# EAGLE design controller_rev4 (EAGLE 9.3.0)

## Sheet 1 of 3: Controller
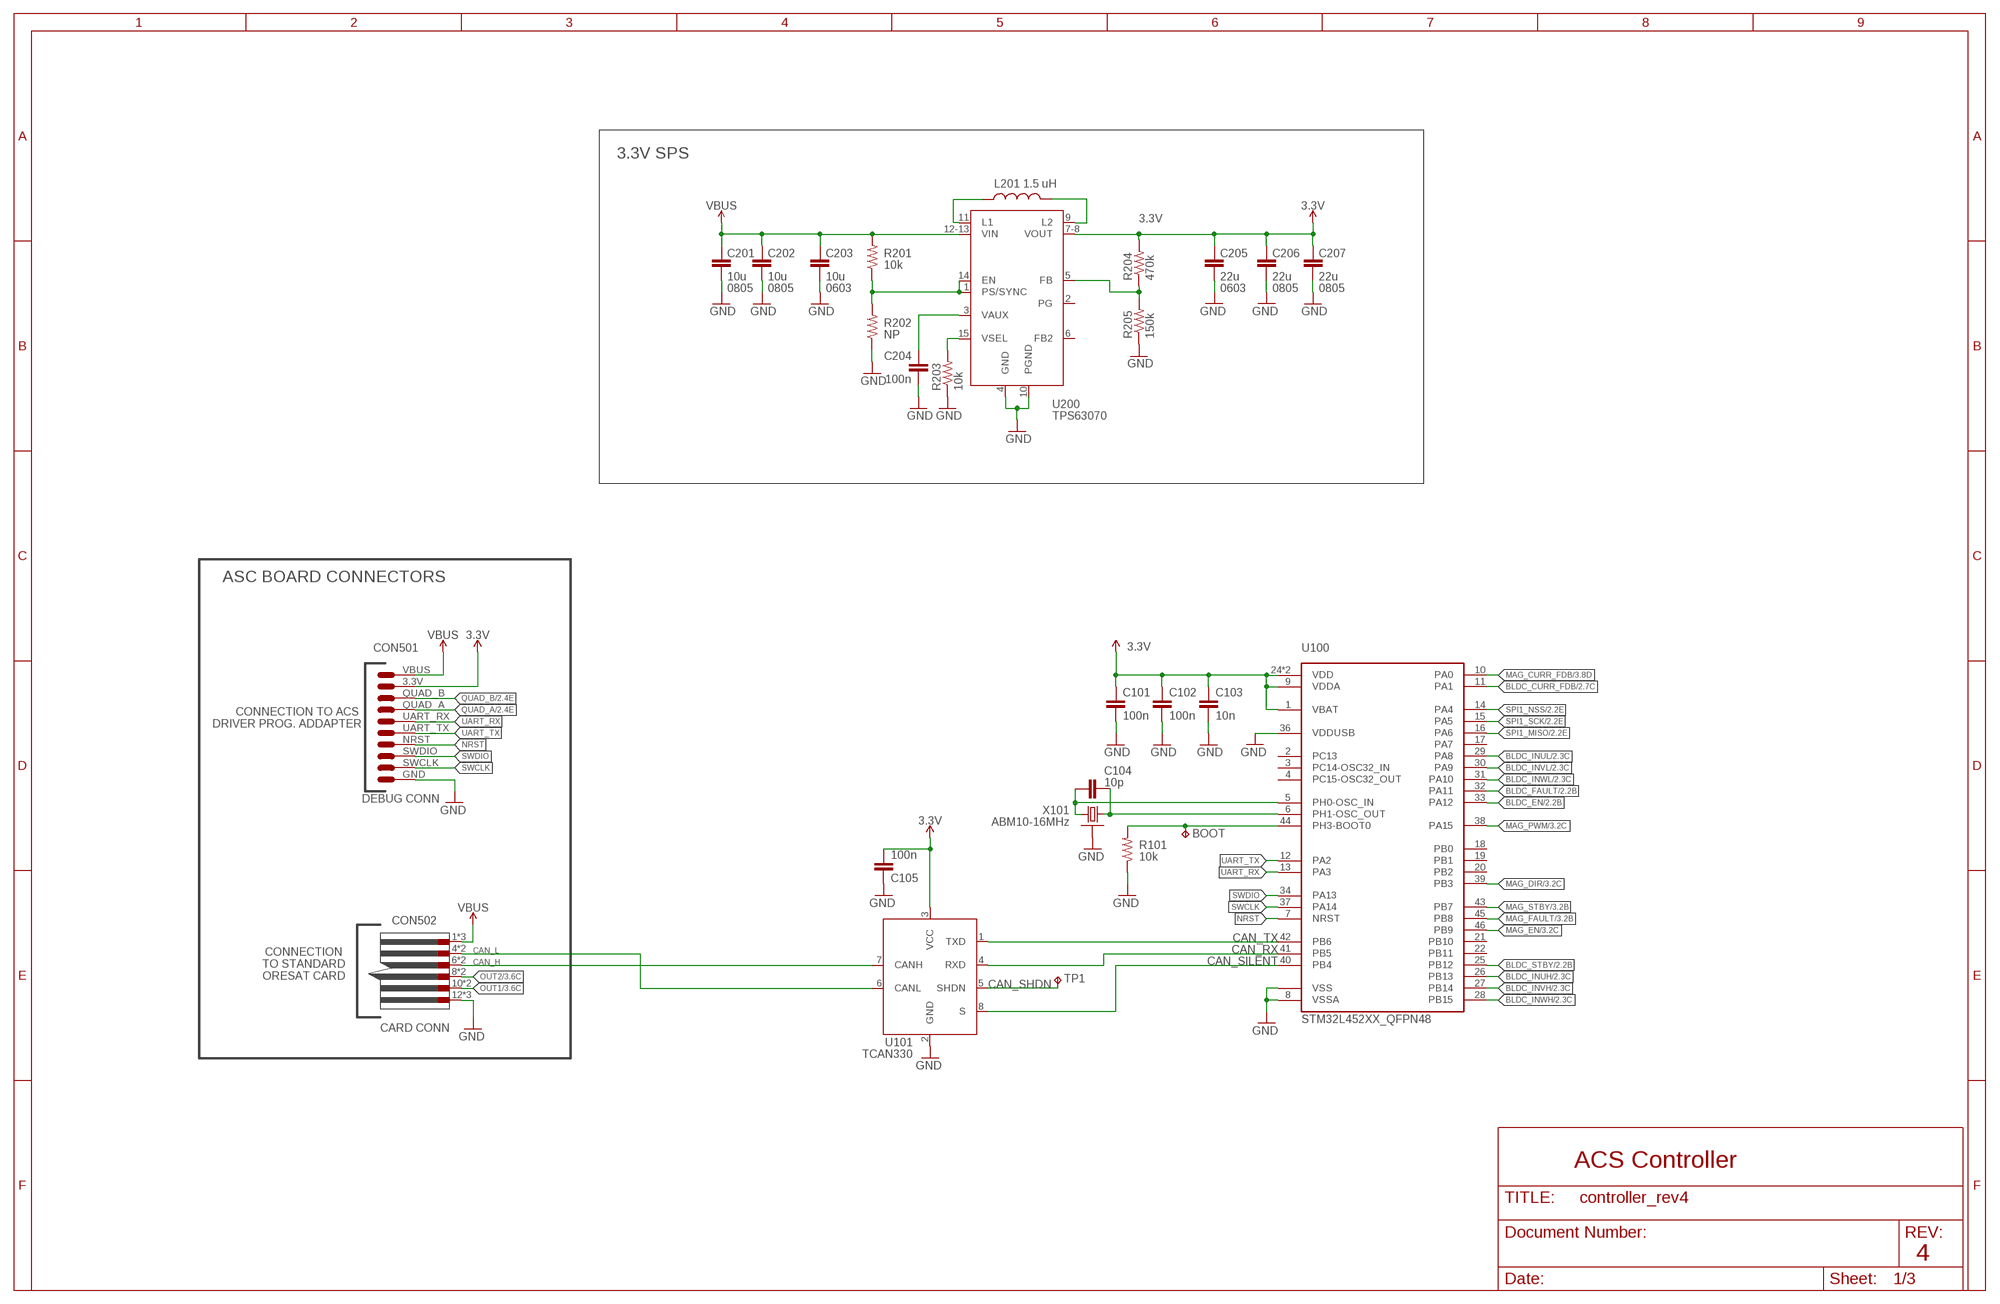
[diagram p0: schematic, sheet 1]

### Parts
BOOT  TPTP15SQ  [TP15SQ]
C101  100n  C-EU0402-B-NOSILK  [.0402-B-NOSILK]
C102  100n  C-EU0402-B-NOSILK  [.0402-B-NOSILK]
C103  10n  C-EU0402-B-NOSILK  [.0402-B-NOSILK]
C104  10p  C-EU0402-B-NOSILK  [.0402-B-NOSILK]
C105  100n  C-EU0402-B-NOSILK  [.0402-B-NOSILK]
C201  10u  C-EU0805-B-NOSILK  [.0805-B-NOSILK]
C202  10u  C-EU0805-B-NOSILK  [.0805-B-NOSILK]
C203  10u  C-EU0603-B-NOSILK  [.0603-B-NOSILK]
C204  100n  C-EU0402-B-NOSILK  [.0402-B-NOSILK]
C205  22u  C-EU0603-B-NOSILK  [.0603-B-NOSILK]
C206  22u  C-EU0805-B-NOSILK  [.0805-B-NOSILK]
C207  22u  C-EU0805-B-NOSILK  [.0805-B-NOSILK]
C501  DEBUG_CON  [DEBUG_CON]
CON502  CARD CONN  LOW-PROFILE_CONNECTOR(TAB)  [LOW-PROFILE_CONNECTOR(TAB)]
L201  1.5 uH  L-COILCRAFT-XFL4020  [L-COILCRAFT-XFL4020]
R101  10k  R-US_0402-B-NOSILK  [.0402-B-NOSILK]
R201  10k  R-US_0402-B-NOSILK  [.0402-B-NOSILK]
R202  NP  R-US_0402-B-NOSILK  [.0402-B-NOSILK]
R203  10k  R-US_0402-B-NOSILK  [.0402-B-NOSILK]
R204  470k  R-US_0402-B-NOSILK  [.0402-B-NOSILK]
R205  150k  R-US_0402-B-NOSILK  [.0402-B-NOSILK]
TP1  TPTP06R  [TP06R]
U100  STM32L452XX_QFPN48  [QFPN-48]
U101  TCAN330  [SOT23-8_TI-DCN]
U200  TPS63070  TPS63070X  [TPS63070X]
X101  ABM10-16MHz  CRYSTAL-WITH-GND  [CRYSTAL_2.5X2]

### Nets
3.3V: C101.1 C102.1 C103.1 C105.2 C205.1 C206.1 C207.1 C501.3.3V R204.2 U100.1(VBAT) U100.9(VDDA) U100.24(VDD) U100.48(VDD) U101.3(VCC) U200.7-8(VOUT) ; also sheet 2,3
BLDC_CURR_FDB: U100.11(PA1) ; also sheet 2
BLDC_EN: U100.33(PA12) ; also sheet 2
BLDC_FAULT: U100.32(PA11) ; also sheet 2
BLDC_INUH: U100.26(PB13) ; also sheet 2
BLDC_INUL: U100.29(PA8) ; also sheet 2
BLDC_INVH: U100.27(PB14) ; also sheet 2
BLDC_INVL: U100.30(PA9) ; also sheet 2
BLDC_INWH: U100.28(PB15) ; also sheet 2
BLDC_INWL: U100.31(PA10) ; also sheet 2
BLDC_STBY: U100.25(PB12) ; also sheet 2
BOOT: BOOT.TP R101.2 U100.44(PH3-BOOT0)
CAN_H: CON502.6 CON502.7 U101.7(CANH)
CAN_L: CON502.4 CON502.5 U101.6(CANL)
CAN_RX: U100.41(PB5) U101.4(RXD)
CAN_SHDN: TP1.TP U101.5(SHDN)
CAN_SILENT: U100.40(PB4) U101.8(S)
CAN_TX: U100.42(PB6) U101.1(TXD)
CLK1: C104.1 U100.5(PH0-OSC_IN) X101.3
CLK2: C104.2 U100.6(PH1-OSC_OUT) X101.1
GND: C101.2 C102.2 C103.2 C105.1 C201.2 C202.2 C203.2 C204.2 C205.2 C206.2 C207.2 C501.GND CON502.12 CON502.13 CON502.14 R101.1 R202.1 R203.1 R205.1 U100.8(VSSA) U100.23(VSS) U100.35(VSS) U100.36(VDDUSB) U100.47(VSS) U100.EPAD(VSS) U101.2(GND) U200.4(GND) U200.10(PGND) X101.2(SHIELD) X101.4(SHIELD) ; also sheet 2,3
MAG_CURR_FDB: U100.10(PA0) ; also sheet 3
MAG_DIR: U100.39(PB3) ; also sheet 3
MAG_EN: U100.46(PB9) ; also sheet 3
MAG_FAULT: U100.45(PB8) ; also sheet 3
MAG_PWM: U100.38(PA15) ; also sheet 3
MAG_STBY: U100.43(PB7) ; also sheet 3
NRST: C501.NRST U100.7(NRST)
OUT1: CON502.10 CON502.11 ; also sheet 3
OUT2: CON502.8 CON502.9 ; also sheet 3
QUAD_A: C501.QUAD_A ; also sheet 2
QUAD_B: C501.QUAD_B ; also sheet 2
SPI1_MISO: U100.16(PA6) ; also sheet 2
SPI1_NSS: U100.14(PA4) ; also sheet 2
SPI1_SCK: U100.15(PA5) ; also sheet 2
SWCLK: C501.SWCLK U100.37(PA14)
SWDIO: C501.SWDIO U100.34(PA13)
TPS-EN2: R201.1 R202.2 U200.1(PS/SYNC) U200.14(EN)
TPS-FB2: R204.1 R205.2 U200.5(FB)
TPS-L5: L201.1 U200.11(L1)
TPS-L6: L201.2 U200.9(L2)
TPS-VAUX2: C204.1 U200.3(VAUX)
TPS-VSEL2: R203.2 U200.15(VSEL)
UART_RX: C501.UART_RX U100.13(PA3)
UART_TX: C501.UART_TX U100.12(PA2)
V_BATT: C501.VBUS ; supply symbol labelled VBUS
VBUS: C201.1 C202.1 C203.1 CON502.1 CON502.2 CON502.3 R201.2 U200.12-13(VIN) ; also sheet 2,3
Unconnected: U100.2(PC13) U100.3(PC14-OSC32_IN) U100.4(PC15-OSC32_OUT) U100.17(PA7) U100.18(PB0) U100.19(PB1) U100.20(PB2) U100.21(PB10) U100.22(PB11) U200.2(PG) U200.6(FB2)

### Notes on the sheet
- 3.3V SPS
- 0805 | 0805 | 0603 | 0603 | 0805 | 0805
- ASC BOARD CONNECTORS
- CON501
- CONNECTION TO ACS 
  DRIVER PROG. ADDAPTER
- DEBUG CONN
- CONNECTION 
  TO STANDARD
  ORESAT CARD
- ACS Controller
- 4

## Sheet 2 of 3: Reaction Wheel
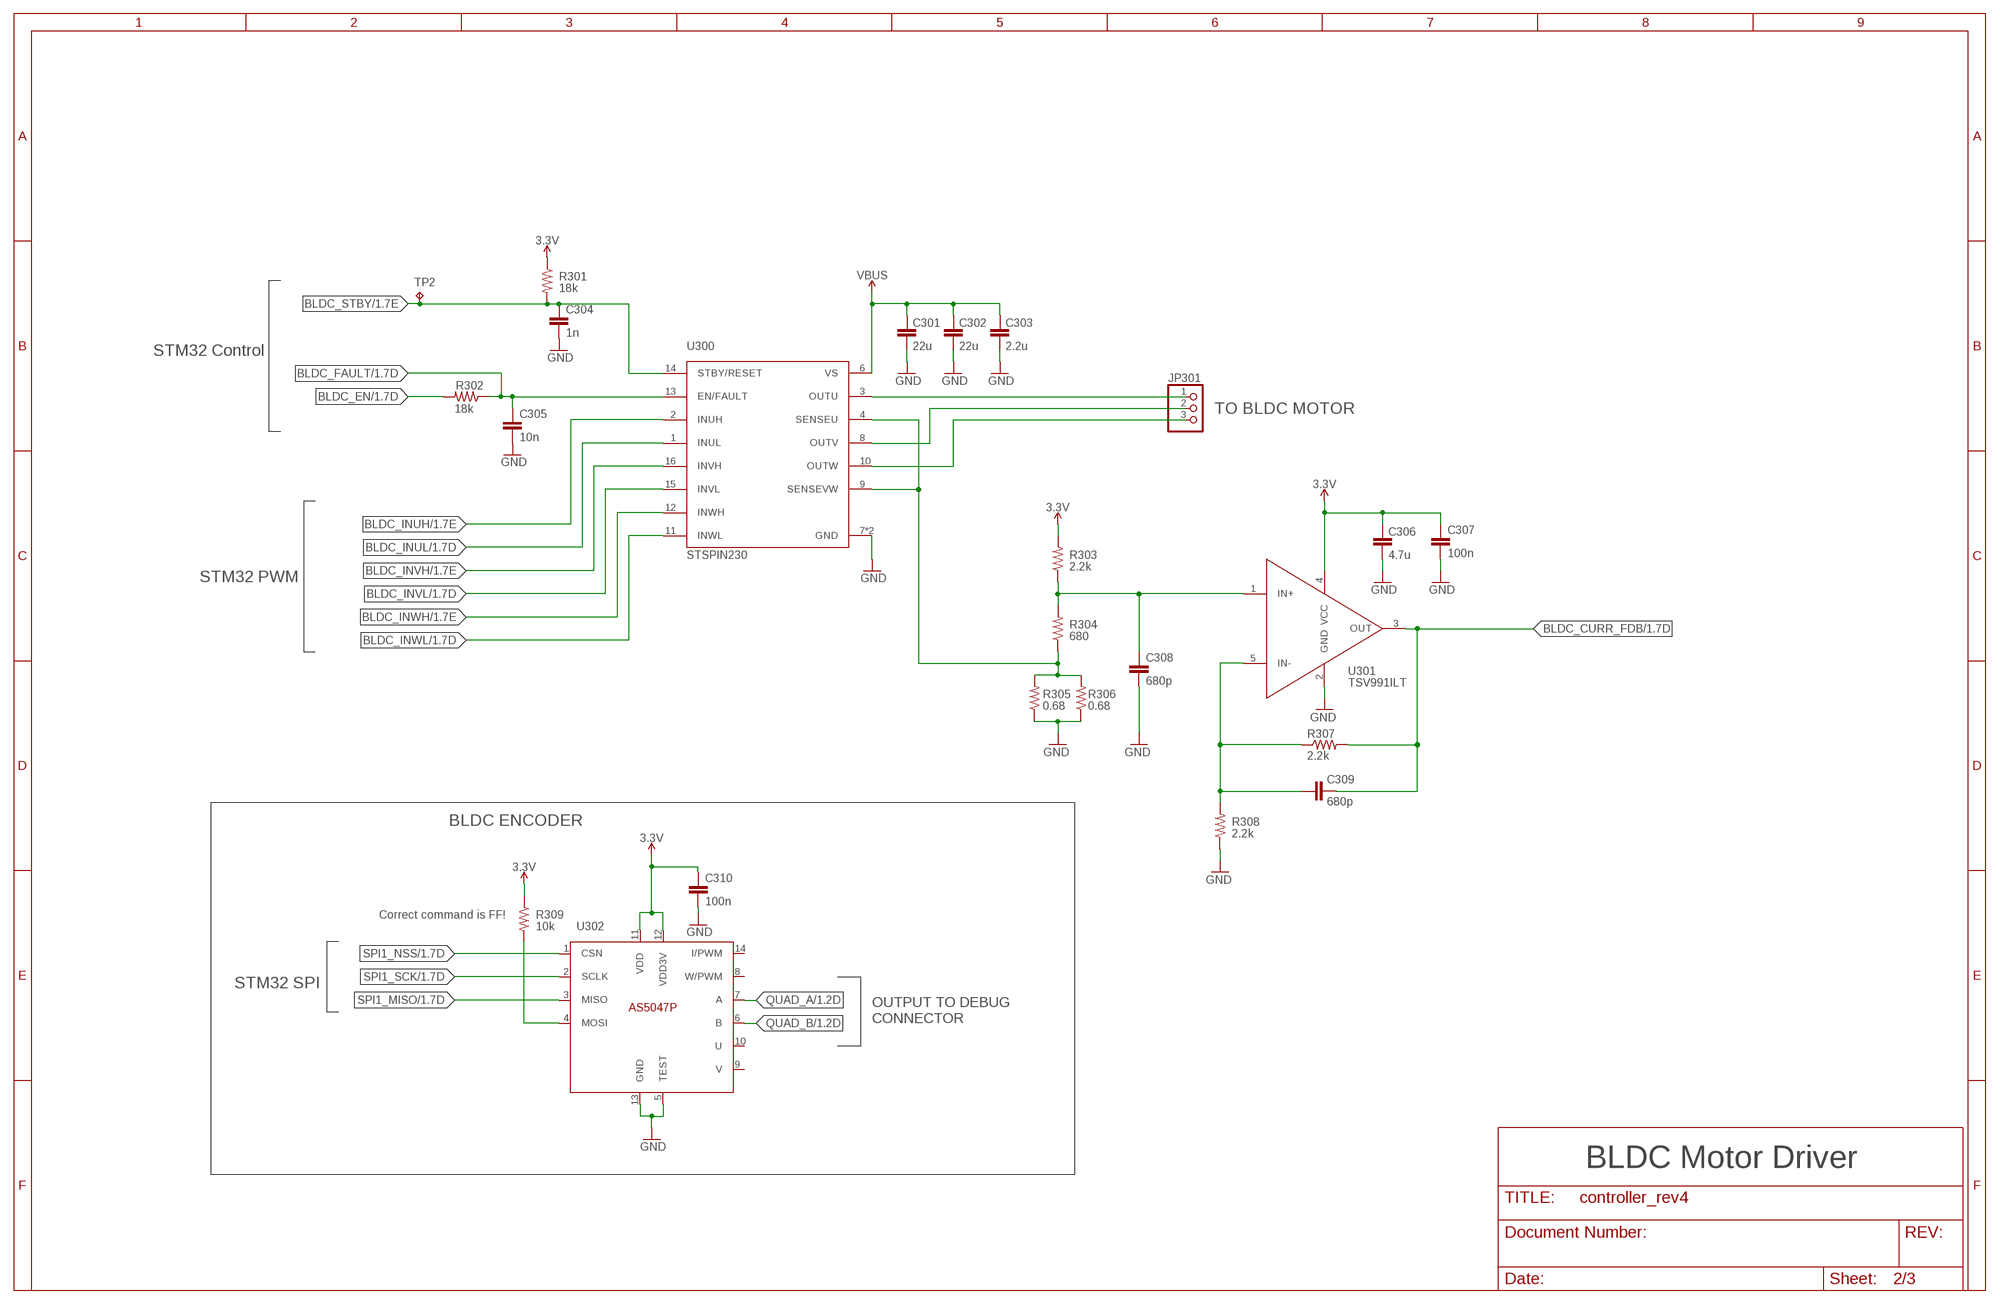
[diagram p1: schematic, sheet 2]

### Parts
C301  22u  C-EU0603-B-NOSILK  [.0603-B-NOSILK]
C302  22u  C-EU0603-B-NOSILK  [.0603-B-NOSILK]
C303  2.2u  C-EU0603-B-NOSILK  [.0603-B-NOSILK]
C304  1n  C-EU0402-B-NOSILK  [.0402-B-NOSILK]
C305  10n  C-EU0402-B-NOSILK  [.0402-B-NOSILK]
C306  4.7u  C-EU0603-B-NOSILK  [.0603-B-NOSILK]
C307  100n  C-EU0402-B-NOSILK  [.0402-B-NOSILK]
C308  680p  C-EU0402-B-NOSILK  [.0402-B-NOSILK]
C309  680p  C-EU0402-B-NOSILK  [.0402-B-NOSILK]
C310  100n  C-EU0402-B-NOSILK  [.0402-B-NOSILK]
JP301  PINHD-1X03_2.00  [1X03M]
R301  18k  R-US_0402-B-NOSILK  [.0402-B-NOSILK]
R302  18k  R-US_0402-B-NOSILK  [.0402-B-NOSILK]
R303  2.2k  R-US_0402-B-NOSILK  [.0402-B-NOSILK]
R304  680  R-US_0402-B-NOSILK  [.0402-B-NOSILK]
R305  0.68  R-US_0805-B-NOSILK  [.0805-B-NOSILK]
R306  0.68  R-US_0805-B-NOSILK  [.0805-B-NOSILK]
R307  2.2k  R-US_0402-B-NOSILK  [.0402-B-NOSILK]
R308  2.2k  R-US_0402-B-NOSILK  [.0402-B-NOSILK]
R309  10k  R-US_0402-B-NOSILK  [.0402-B-NOSILK]
TP2  TPTP06R  [TP06R]
U300  STSPIN230  [VFQPN]
U301  TSV991ILT  [SOT23-5]
U302  AS5047P  [TSSOP14]

### Nets
3.3V: C306.1 C307.1 C310.1 R301.1 R303.2 R309.1 U301.4(VCC) U302.11(VDD) U302.12(VDD3V) ; also sheet 1,3
AS5047_MOSI: R309.2 U302.4(MOSI)
B_IN+: C308.1 R303.1 R304.2 U301.1(IN+)
B_IN-: C309.2 R307.1 R308.2 U301.5(IN-)
BLDC_CURR_FDB: C309.1 R307.2 U301.3(OUT) ; also sheet 1
BLDC_EN: R302.2 ; also sheet 1
BLDC_FAULT: C305.1 R302.1 U300.13(EN/FAULT) ; also sheet 1
BLDC_INUH: U300.2(INUH) ; also sheet 1
BLDC_INUL: U300.1(INUL) ; also sheet 1
BLDC_INVH: U300.16(INVH) ; also sheet 1
BLDC_INVL: U300.15(INVL) ; also sheet 1
BLDC_INWH: U300.12(INWH) ; also sheet 1
BLDC_INWL: U300.11(INWL) ; also sheet 1
BLDC_STBY: C304.1 R301.2 TP2.TP U300.14(STBY/RESET) ; also sheet 1
GND: C301.2 C302.2 C303.2 C304.2 C305.2 C306.2 C307.2 C308.2 C310.2 R305.1 R306.1 R308.1 U300.7(GND) U300.EPAD(GND) U301.2(GND) U302.5(TEST) U302.13(GND) ; also sheet 1,3
QUAD_A: U302.7(A) ; also sheet 1
QUAD_B: U302.6(B) ; also sheet 1
SENSE_BLDC: R304.1 R305.2 R306.2 U300.4(SENSEU) U300.9(SENSEVW)
SPI1_MISO: U302.3(MISO) ; also sheet 1
SPI1_NSS: U302.1(CSN) ; also sheet 1
SPI1_SCK: U302.2(SCLK) ; also sheet 1
U: JP301.1 U300.3(OUTU)
V: JP301.2 U300.8(OUTV)
VBUS: C301.1 C302.1 C303.1 U300.6(VS) ; also sheet 1,3
W: JP301.3 U300.10(OUTW)
Unconnected: U302.8(W/PWM) U302.9(V) U302.10(U) U302.14(I/PWM)

### Notes on the sheet
- STM32 Control
- TO BLDC MOTOR
- STM32 PWM
- BLDC ENCODER
- Correct command is FF!
- STM32 SPI
- OUTPUT TO DEBUG 
  CONNECTOR
- BLDC Motor Driver

## Sheet 3 of 3: Magnetorquer
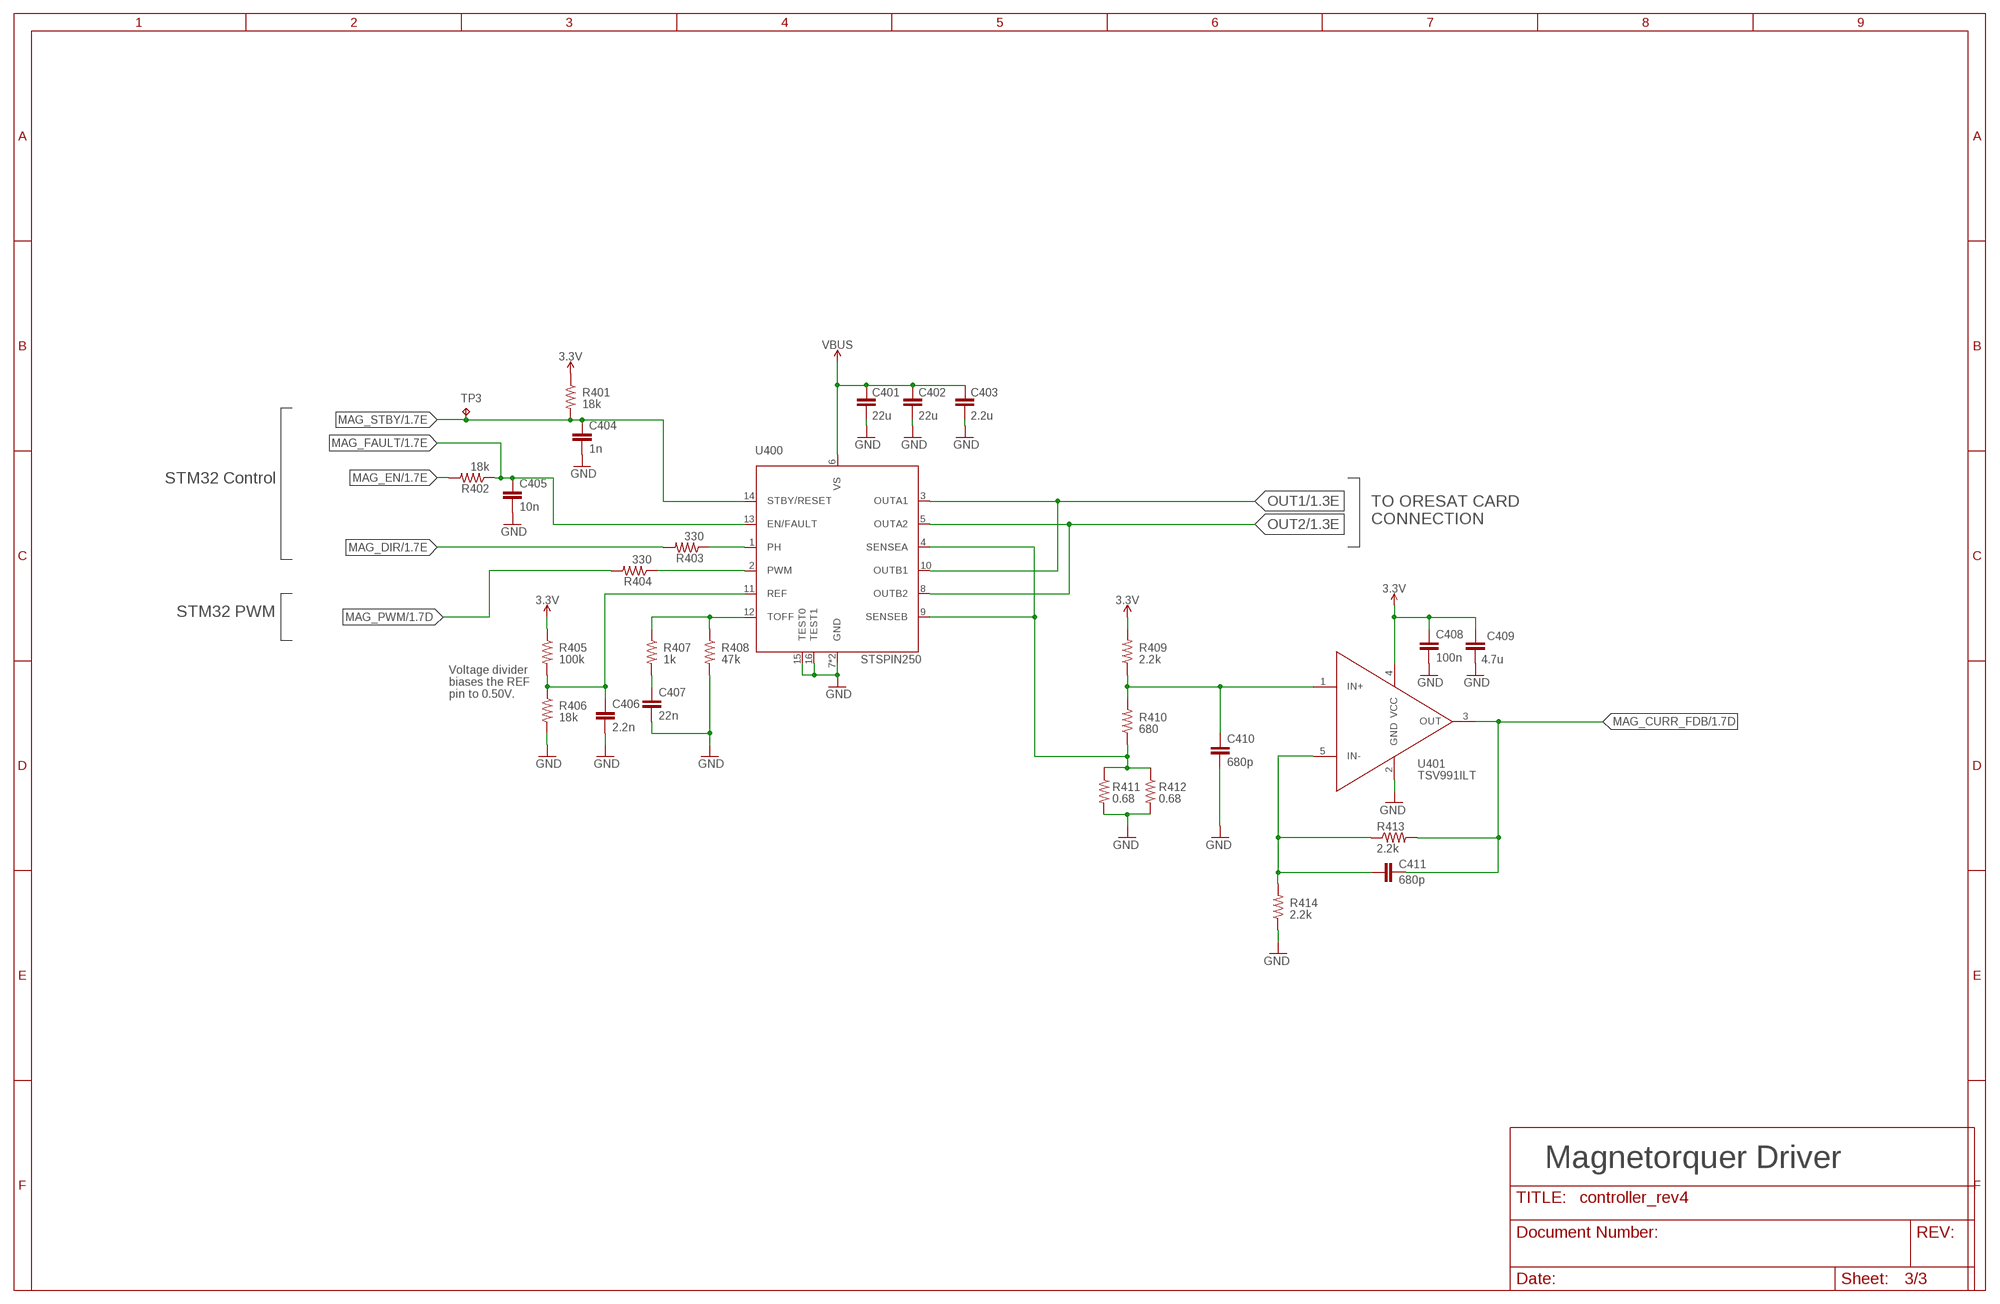
[diagram p2: schematic, sheet 3]

### Parts
C401  22u  C-EU0603-B-NOSILK  [.0603-B-NOSILK]
C402  22u  C-EU0603-B-NOSILK  [.0603-B-NOSILK]
C403  2.2u  C-EU0603-B-NOSILK  [.0603-B-NOSILK]
C404  1n  C-EU0402-B-NOSILK  [.0402-B-NOSILK]
C405  10n  C-EU0402-B-NOSILK  [.0402-B-NOSILK]
C406  2.2n  C-EU0402-B-NOSILK  [.0402-B-NOSILK]
C407  22n  C-EU0402-B-NOSILK  [.0402-B-NOSILK]
C408  100n  C-EU0402-B-NOSILK  [.0402-B-NOSILK]
C409  4.7u  C-EU0603-B-NOSILK  [.0603-B-NOSILK]
C410  680p  C-EU0402-B-NOSILK  [.0402-B-NOSILK]
C411  680p  C-EU0402-B-NOSILK  [.0402-B-NOSILK]
R401  18k  R-US_0402-B-NOSILK  [.0402-B-NOSILK]
R402  18k  R-US_0402-B-NOSILK  [.0402-B-NOSILK]
R403  330  R-US_0402-B-NOSILK  [.0402-B-NOSILK]
R404  330  R-US_0402-B-NOSILK  [.0402-B-NOSILK]
R405  100k  R-US_0402-B-NOSILK  [.0402-B-NOSILK]
R406  18k  R-US_0402-B-NOSILK  [.0402-B-NOSILK]
R407  1k  R-US_0402-B-NOSILK  [.0402-B-NOSILK]
R408  47k  R-US_0402-B-NOSILK  [.0402-B-NOSILK]
R409  2.2k  R-US_0402-B-NOSILK  [.0402-B-NOSILK]
R410  680  R-US_0402-B-NOSILK  [.0402-B-NOSILK]
R411  0.68  R-US_0805-B-NOSILK  [.0805-B-NOSILK]
R412  0.68  R-US_0805-B-NOSILK  [.0805-B-NOSILK]
R413  2.2k  R-US_0402-B-NOSILK  [.0402-B-NOSILK]
R414  2.2k  R-US_0402-B-NOSILK  [.0402-B-NOSILK]
TP3  TPTP06R  [TP06R]
U400  STSPIN250  [VFQPN]
U401  TSV991ILT  [SOT23-5]

### Nets
3.3V: C408.1 C409.1 R401.1 R405.1 R409.2 U401.4(VCC) ; also sheet 1,2
250_REF: C406.1 R405.2 R406.1 U400.11(REF)
250_TOFF: R407.1 R408.1 U400.12(TOFF)
GND: C401.2 C402.2 C403.2 C404.2 C405.2 C406.2 C407.2 C408.2 C409.2 C410.2 R406.2 R408.2 R411.2 R412.2 R414.1 U400.7(GND) U400.15(TEST0) U400.16(TEST1) U400.EPAD(GND) U401.2(GND) ; also sheet 1,2
M_IN+: C410.1 R409.1 R410.2 U401.1(IN+)
M_IN-: C411.2 R413.1 R414.2 U401.5(IN-)
M_PH: R403.1 U400.1(PH)
M_PWM: R404.1 U400.2(PWM)
MAG_CURR_FDB: C411.1 R413.2 U401.3(OUT) ; also sheet 1
MAG_DIR: R403.2 ; also sheet 1
MAG_EN: R402.2 ; also sheet 1
MAG_FAULT: C405.1 R402.1 U400.13(EN/FAULT) ; also sheet 1
MAG_PWM: R404.2 ; also sheet 1
MAG_STBY: C404.1 R401.2 TP3.TP U400.14(STBY/RESET) ; also sheet 1
OUT1: U400.3(OUTA1) U400.10(OUTB1) ; also sheet 1
OUT2: U400.5(OUTA2) U400.8(OUTB2) ; also sheet 1
SENSE_MAG: R410.1 R411.1 R412.1 U400.4(SENSEA) U400.9(SENSEB)
TOFF1: C407.1 R407.2
VBUS: C401.1 C402.1 C403.1 U400.6(VS) ; also sheet 1,2

### Notes on the sheet
- STM32 Control
- TO ORESAT CARD 
  CONNECTION
- STM32 PWM
- Voltage divider
  biases the REF
  pin to 0.50V.
- Magnetorquer Driver

## Library data of the parts
BOOT TP1-TP3 = testpad:TP: Test pad
C101-C103 C105 C204 C304 C305 C307-C310 C404-C408 C410 C411 = rcl_custom:C-EU: CAPACITOR, European symbol; DIS: Digi-Key; DPN: 1276-1001-1-ND; MFR: Samsung; MPN: CL05B104KO5NNNC
C104 = rcl_custom:C-EU: CAPACITOR, European symbol; DIS: Digi-Key; DPN: 1276-6601-1-ND; MFR: Samsung; MPN: CL05C200JB51PNC
C201 C202 C206 C207 = oresat-rcl:C-EU: CAPACITOR, European symbol
C203 C205 C301-C303 C306 C401-C403 C409 = oresat-rcl:C-EU: CAPACITOR, European symbol; DIS: Digi-Key; DPN: 1276-1001-1-ND; MFR: Samsung; MPN: CL05B104KO5NNNC
C501 = oresat-ACS_driver_board:DEBUG_CON
CON502 = oresat-ACS_driver_board:LOW-PROFILE_CONNECTOR(TAB)
JP301 = pinhead-2:PINHD-1X03: PIN HEADER
L201 = L-Coilcraft-XFL4020:L-COILCRAFT-XFL4020; DIS: Mouser; DPN: 994-XFL4020-152MEB; MFR: Coilcraft; MPN: XFL4020-152ME
R101 R201-R205 R301-R304 R307-R309 R401-R410 R413 R414 = rcl_custom:R-US_: RESISTOR, American symbol; DIS: Digi-Key; DPN: 1276-4275-1-ND; MFR: Samsung; MPN: RC1005F6653CS
R305 R306 R411 R412 = oresat-rcl:R-US_: RESISTOR, American symbol
U100 = oresat-ACS_driver_board:STM32L452XX_QFPN48
U101 = TCAN330:TCAN330; DIS: Digi-Key; DPN: 296-44211-1-ND; MFR: Texas Instruments; MPN: TCAN330GDCNT
U200 = ic-pwr-tps63070x:TPS63070X: TPS63070 2-V to 16-V Buck-Boost Converter With 3.6-A Switch Current; DIS: Digi-Key; DPN: 296-44874-1-ND; MFR: TI; MPN: TPS63070
U300 = oresat-ACS_driver_board:STSPIN230
U301 U401 = oresat-ACS_driver_board:TSV991ILT
U302 = U-AMS-AS5047P-encoder:AS5047P
U400 = oresat-ACS_driver_board:STSPIN250
X101 = low-gain-radio:CRYSTAL-WITH-GND; DIS: Digi-Key; DPN: XC2181CT-ND; MFR: ECS Inc.; MPN: ECS-160-10-36Q-ES-TR

## Board
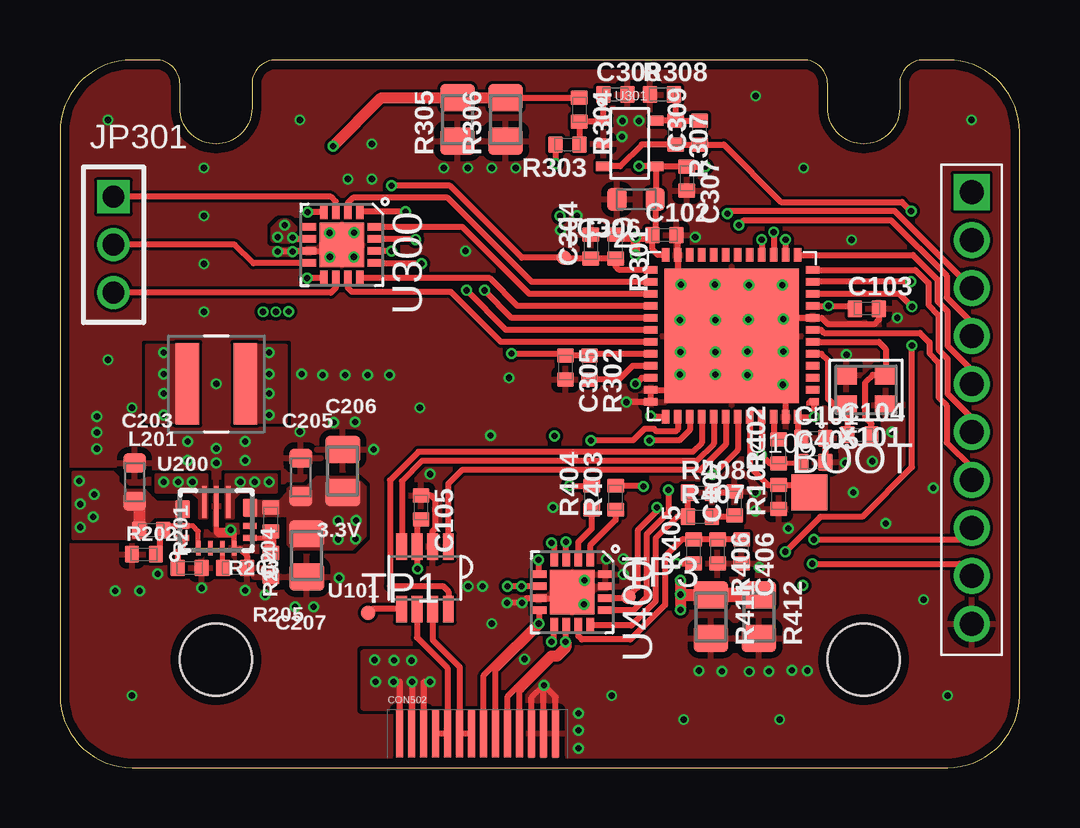
[diagram p3: board, top side]
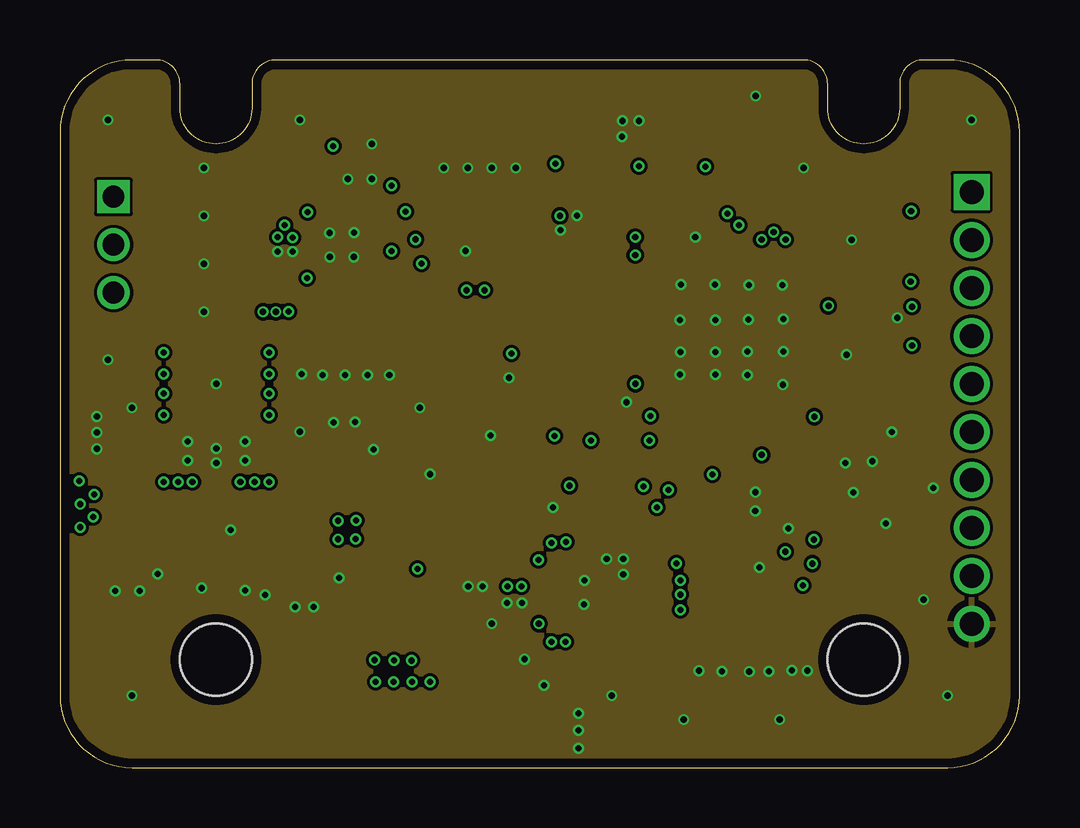
[diagram p4: board, inner layer Route2]
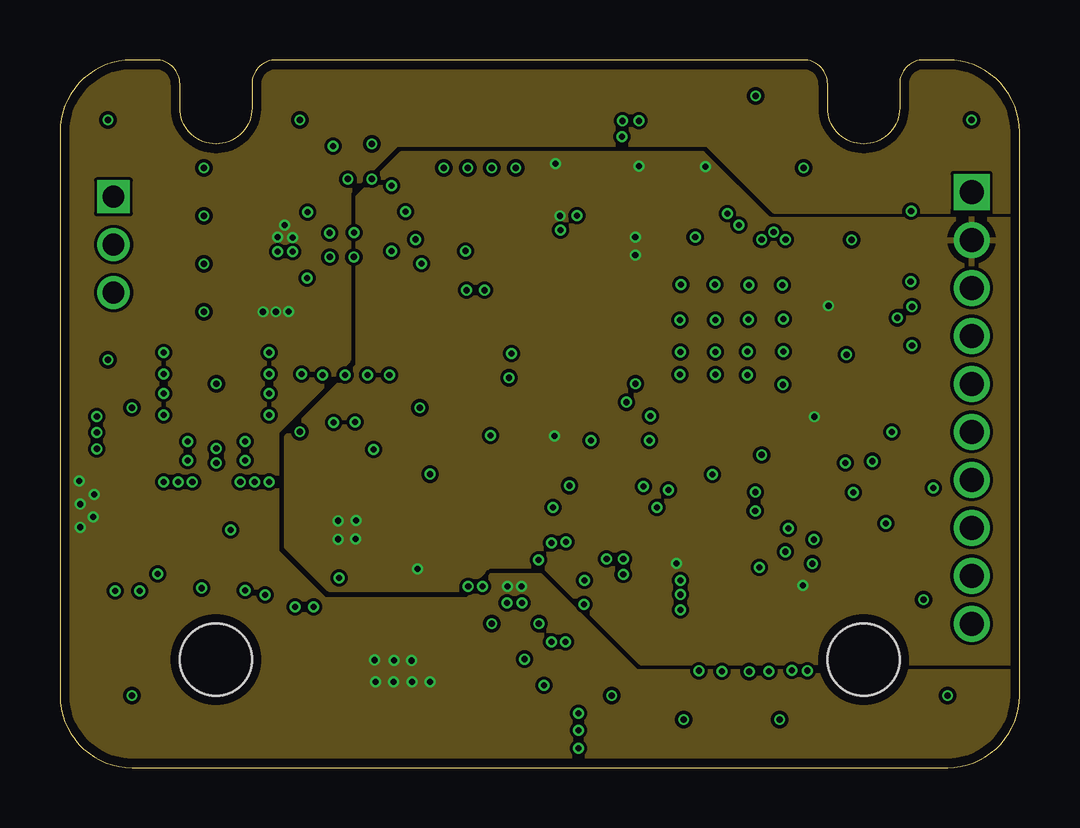
[diagram p5: board, inner layer Route15]
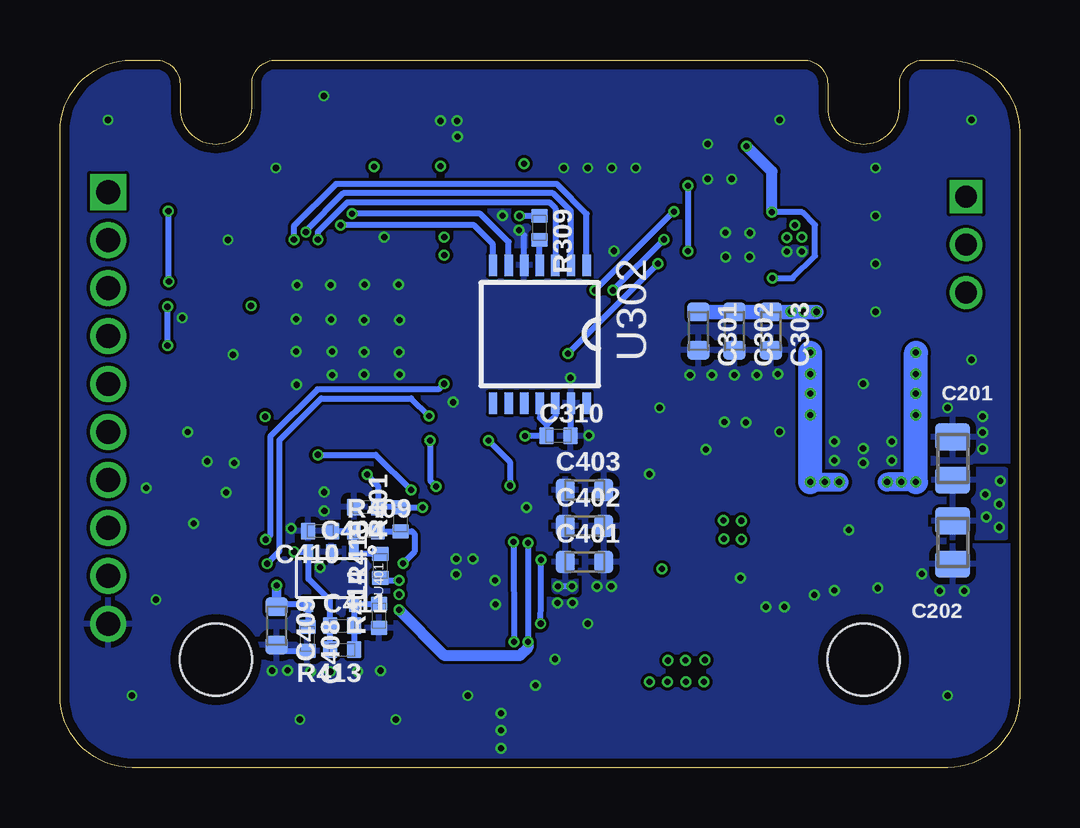
[diagram p6: board, bottom side, seen from below]

Size 40 x 29.5 mm. Coordinates in mm from the lower left corner, seen from the top.
Outline: 3,0 37,0 arc90 40,3 40,26.5 arc90 37,29.5 36,29.5 arc90 35,28.5 35,27.5 arc-90 33.5,26 arc-90 32,27.5 32,28.5 arc90 31,29.5 9,29.5 arc90 8,28.5 8,27.5 arc-90 6.5,26 arc-90 5,27.5 5,28.5 arc90 4,29.5 3,29.5 arc90 0,26.5 0,3 arc90 3,0
Copper layers (1*2*15*16): Top 0.035559375mm / dielectric 0.17018125mm / Route2 0.01778125mm / dielectric 47mil / Route15 0.01778125mm / dielectric 0.17018125mm / Bottom 0.035559375mm
Design rules "Osh park 4 layer *": minimum track width 5mil, minimum drill 10mil, track to track 5mil, track to pad 5mil, pad to pad 5mil, via to via 5mil, smd to smd 5mil, copper to edge 15mil, drill to drill 6mil, minimum pad ring 4mil, minimum via ring 4mil, stop-mask expansion 2.5mil, vias tented up to drill 11mil, thermal gap 10mil
Holes 3 mm at 6.5,4.5 33.5,4.5
tKeepout: area 4,25 to 9,30; area 4,2 to 9,7; area 31,2 to 36,7; area 31,25 to 36,30

### Footprints (pad centres in the part's own frame; a part is rotated, then mirrored left to right if it is on the bottom)
TP15SQ = smd 1.5 x 1.5: TP 0,0
.0402-B-NOSILK = smd 0.6 x 0.7: 1 -0.5,0; 2 0.5,0
.0805-B-NOSILK = smd 1.15 x 1.45: 1 -0.9,0; 2 0.9,0
.0603-B-NOSILK = smd 0.8 x 0.95: 1 -0.8,0; 2 0.8,0
DEBUG_CON = drill 1: 3.3V 0,6; GND 0,-10; NRST 0,-4; QUAD_A 0,2; QUAD_B 0,4; SWCLK 0,-8; SWDIO 0,-6; UART_RX 0,0; UART_TX 0,-2 | drill 1 square: VBUS 0,8
LOW-PROFILE_CONNECTOR(TAB) = smd 0.3 x 2: 1 -3.25,1; 2 -2.75,1; 3 -2.25,1; 4 -1.75,1; 5 -1.25,1; 6 -0.75,1; 7 -0.25,1; 8 0.25,1; 9 0.75,1; 10 1.25,1; 11 1.75,1; 12 2.25,1; 13 2.75,1; 14 3.25,1
1X03M = drill 0.914 square: 1 -2,0 | drill 0.914: 2 0,0; 3 2,0
L-COILCRAFT-XFL4020 = smd 0.98 x 3.4: 1 -1.2,0; 2 1.2,0
TP06R = smd 0.6 x 0.6: TP 0,0
QFPN-48 = smd 0.38 x 0.28: 1 -3.45,2.75 | smd 0.55 x 0.3: 2 -3.375,2.25; 3 -3.375,1.75; 4 -3.375,1.25; 5 -3.375,0.75; 6 -3.375,0.25; 7 -3.375,-0.25; 8 -3.375,-0.75; 9 -3.375,-1.25; 10 -3.375,-1.75; 11 -3.375,-2.25; 12 -3.375,-2.75; 25 3.375,-2.75; 26 3.375,-2.25; 27 3.375,-1.75; 28 3.375,-1.25; 29 3.375,-0.75; 30 3.375,-0.25; 31 3.375,0.25; 32 3.375,0.75; 33 3.375,1.25; 34 3.375,1.75; 35 3.375,2.25; 36 3.375,2.75 | smd 0.3 x 0.55: 13 -2.75,-3.375; 14 -2.25,-3.375; 15 -1.75,-3.375; 16 -1.25,-3.375; 17 -0.75,-3.375; 18 -0.25,-3.375; 19 0.25,-3.375; 20 0.75,-3.375; 21 1.25,-3.375; 22 1.75,-3.375; 23 2.25,-3.375; 24 2.75,-3.375; 37 2.75,3.375; 38 2.25,3.375; 39 1.75,3.375; 40 1.25,3.375; 41 0.75,3.375; 42 0.25,3.375; 43 -0.25,3.375; 44 -0.75,3.375; 45 -1.25,3.375; 46 -1.75,3.375; 47 -2.25,3.375; 48 -2.75,3.375 | smd 5.6 x 5.6: EPAD 0,0
SOT23-8_TI-DCN = smd 0.45 x 1.1: 1 -0.975,-1.3; 2 -0.325,-1.3; 3 0.325,-1.3; 4 0.975,-1.3; 5 0.975,1.3; 6 0.325,1.3; 7 -0.325,1.3; 8 -0.975,1.3
TPS63070X = smd 0.6 x 0.25: 1 -1.15,0.75; 2 -1.15,0.25; 3 -1.15,-0.25; 4 -1.15,-0.75 | smd 0.25 x 0.6: 5 -0.725,-1.4; 6 -0.225,-1.4; 14 -0.225,1.4; 15 -0.725,1.4 | smd 0.75 x 0.6: 7-8 0.525,-1.4; 12-13 0.475,1.4 | smd 1.35 x 0.25: 9 0.775,-0.5; 11 0.775,0.5 | smd 1.7 x 0.25: 10 0.6,0
VFQPN = smd 0.63 x 0.3: 1 -1.39,0.75; 2 -1.39,0.25; 3 -1.39,-0.25; 4 -1.39,-0.75; 9 1.39,-0.75; 10 1.39,-0.25; 11 1.39,0.25; 12 1.39,0.75 | smd 0.3 x 0.63: 5 -0.75,-1.39; 6 -0.25,-1.39; 7 0.25,-1.39; 8 0.75,-1.39; 13 0.75,1.39; 14 0.25,1.39; 15 -0.25,1.39; 16 -0.75,1.39 | smd 1.85 x 1.85: EPAD 0,0
SOT23-5 = smd 0.6 x 0.4: 1 -1.1,0.95; 2 -1.1,0; 3 -1.1,-0.95; 4 1.1,-0.95; 5 1.1,0.95
TSSOP14 = smd 0.9 x 0.35: 1 -2.875,1.95; 2 -2.875,1.3; 3 -2.875,0.65; 4 -2.875,0; 5 -2.875,-0.65; 6 -2.875,-1.3; 7 -2.875,-1.95; 8 2.875,-1.95; 9 2.875,-1.3; 10 2.875,-0.65; 11 2.875,0; 12 2.875,0.65; 13 2.875,1.3; 14 2.875,1.95
CRYSTAL_2.5X2 = smd 0.9 x 0.8: 1 -0.825,-0.625; 2 0.825,-0.625; 3 0.825,0.625; 4 -0.825,0.625

### Placement (x,y rotation side)
BOOT  31.23,11.46 0 top
C101  31.41,13.73 0 top
C102  25.2,22.2 0 top
C103  33.64,19.13 0 top
C104  33.33,13.87 0 top
C105  15.05,10.84 270 top
C201  2.79,12.88 90 bottom
C202  2.79,9.38 270 bottom
C203  3.11,11.9 90 top
C204  7.3,8.32 0 top
C205  10.04,12.1 90 top
C206  11.79,12.36 90 top
C207  10.29,8.85 270 top
C301  13.39,18.2 270 bottom
C302  11.88,18.2 270 bottom
C303  10.37,18.2 270 bottom
C304  22.13,21.71 90 top
C305  21.07,16.68 270 top
C306  24.02,23.69 180 top
C307  26.13,24.56 270 top
C308  23.15,28.06 0 top
C309  26.66,26.47 90 top
C310  19.22,13.83 0 bottom
C401  18.13,8.57 0 bottom
C402  18.13,10.07 0 bottom
C403  18.13,11.57 0 bottom
C404  27.25,10.86 180 bottom
C405  31.41,12.73 0 top
C406  28.41,9.01 270 top
C407  28.12,11.01 90 top
C408  29.69,5.36 270 bottom
C409  30.97,5.91 270 bottom
C410  29.15,9.86 180 bottom
C411  28.24,5.91 0 bottom
C501  38,16 0 top
CON502  17.41,0.42 0 top
JP301  2.23,21.8 270 top
L201  6.52,16 0 top
R101  29.96,11.28 90 top
R201  3.8,9.9 180 top
R202  3.5,8.89 0 top
R203  5.4,8.32 180 top
R204  8.79,10.35 90 top
R205  8.79,8.45 90 top
R301  23.16,21.72 270 top
R302  22.07,16.68 270 top
R303  21.15,25.97 180 top
R304  21.65,27.42 270 top
R305  16.57,27.02 90 top
R306  18.57,27.02 90 top
R307  25.66,26.47 270 top
R308  25.09,28.06 0 top
R309  20.01,22.5 270 bottom
R401  25.8,10.35 90 bottom
R402  29.96,13.18 90 top
R403  23.16,11.25 90 top
R404  22.16,11.25 90 top
R405  26.41,9.01 90 top
R406  27.41,9.01 270 top
R407  26.67,10.46 0 top
R408  26.67,11.46 0 top
R409  27.25,9.86 0 bottom
R410  26.65,8.41 90 bottom
R411  27.14,6.29 270 top
R412  29.14,6.29 270 top
R413  28.24,4.91 180 bottom
R414  26.7,6.33 90 bottom
TP1  12.84,6.45 0 top
TP2  21.02,21.26 0 top
TP3  23.69,7.12 0 top
U100  28,18 180 top
U101  15.21,7.91 180 top
U200  6.52,10.3 90 top
U300  11.75,21.79 270 top
U301  23.75,26.02 0 top
U302  20,18.07 270 bottom
U400  21.35,7.31 270 top
U401  28.7,7.9 270 bottom
X101  33.6,15.74 180 top

### Tracks (layer width: path | path; a pad name or v marks a point on that pad's centre or on a via)
3.3V  (via drill 0.25)
  Top 0.25: U100.9 v32.04,19.25 33.02,19.25 C103.1 | U100.48 30.75,13.89 C101.1 | v25.7,8.51 R405.1 | C105.2 14.88,10.18 U101.3 | R301.1 23.26,22.12 | 24.67,22.12 24.7,22.15
  Top 0.254: U100.24 24.93,21.38 24.7,21.6 24.7,22.15 | 24.7,22.15 C102.1 | U100.48 v31.45,14.62 U100.1 | U301.4 24.85,23.72 C306.1 24.82,22.27 24.7,22.15 | U301.4 C307.1 v26.9,25.06 | U301.4 v24.14,25.07 | R303.2 v20.65,25.17 | U101.3 14.88,8.29 v14.9,8.28
  Top 0.4: 23.26,22.12 v23.98,22.12 | v23.98,22.12 24.67,22.12 | v23.98,22.12 v23.98,21.37
  Bottom 0.25: R409.2 R401.1 25.33,9.85 25.22,9.74 25.22,8.99 v25.7,8.51 | U302.12 19.35,14.66 19.72,14.29 | 19.72,14.29 19.72,14.3 20,14.58 U302.11 | 19.72,14.29 C310.1
  Bottom 0.254: C408.1 29.65,5.89 U401.4 30.88,6.8 C409.1 | R309.1 v20.85,23 | C310.1 v20.61,13.82
  Bottom 0.4: C409.1 v30.97,7.6
  other vias: 11.59,10.29 12.34,10.3 12.33,9.53 11.59,9.52
  pour Top (rank 2, no thermals): 7.72,11.1 9.16,11.1 9.52,11.46 9.52,11.61 9.61,11.7 10.3,11.7 10.7,12.1 12.31,12.1 12.72,11.69 12.72,9.65 12.18,9.11 9.7,9.11 9.5,9.31 9.5,10.52 7.72,10.52
  pour Route15 (rank 6): 40,22.84 29.53,22.84 26.79,25.58 14.24,25.58 12.42,23.76 12.42,16.74 9.45,13.77 9.45,9.21 11.21,7.45 16.9,7.45 17.88,8.43 20.16,8.43 24.2,4.39 40,4.39
250_REF
  Top 0.25: C406.1 R406.1 R405.2 25.93,9.51 25.22,8.8 25.22,6.78 23.78,5.34 21.75,5.34 21.61,5.48 U400.11
250_TOFF
  Top 0.25: R408.1 R407.1 25.73,10.46 24.83,9.56 24.83,6.93 23.82,5.92 U400.12
AS5047_MOSI
  Bottom 0.254: U302.4 R309.2
B_IN+
  Top 0.254: R303.1 R304.2 22.6,26.92 U301.1 C308.1
B_IN-
  Top 0.254: R308.2 25.66,27.99 R307.1 | R307.1 C309.2 | R307.1 U301.5
BLDC_CURR_FDB  (via drill 0.25)
  Top 0.254: U301.3 23.35,25.07 24.25,25.97 R307.2 C309.1 27.67,25.97 30.06,23.58 35.1,23.58 v35.48,23.2 | v35.46,20.26 U100.11
  Bottom 0.254: v35.48,23.2 35.48,20.28 v35.46,20.26
BLDC_EN
  Top 0.254: U100.33 23.87,16.75 23.3,16.18 R302.2
BLDC_FAULT  (via drill 0.25)
  Top 0.25: R302.1 C305.1
  Top 0.254: U300.13 13.17,21.01 v15.08,21.01 | v18.83,17.26 18.83,17.25 21,17.25 C305.1 | U100.32 22.14,17.25 R302.1
  Bottom 0.254: v18.83,17.26 v15.08,21.01
BLDC_INUH
  Top 0.254: U100.26 19.67,20.25 16.16,23.76 12.21,23.76 12,23.55 U300.2
BLDC_INUL  (via drill 0.25)
  Top 0.254: v17.69,19.9 17.69,19.89 18.83,18.75 U100.29 | v14.4,23.17 v14.39,23.18 U300.1
  Bottom 0.254: v17.69,19.9 14.42,23.17 v14.4,23.17
BLDC_INVH
  Top 0.254: U100.27 19.57,19.75 16.78,22.54 U300.16
BLDC_INVL  (via drill 0.25)
  Top 0.254: U100.30 18.59,18.25 v16.94,19.9 | v14.82,22.02 14.8,22.04 U300.15
  Bottom 0.254: v16.94,19.9 v14.82,22.02
BLDC_INWH
  Top 0.254: U100.28 19.07,19.25 17.92,20.4 U300.12
BLDC_INWL
  Top 0.254: U100.31 18.38,17.75 16.3,19.83 12.17,19.83 12,20 U300.11
BLDC_STBY  (via drill 0.25)
  Top 0.254: U100.25 23.31,20.75 23.16,20.9 R301.2 C304.1 21.07,21.21 TP2.TP 19.26,21.26 16.27,24.25 v13.82,24.25 | v13.82,21.53 U300.14
  Bottom 0.254: v13.82,24.25 v13.82,21.53
BOOT
  Top 0.25: U100.44 28.75,12.54 29.51,11.78 R101.2 30.91,11.78 BOOT.TP
CAN_H
  Top 0.254: U101.7 15.54,5.31 16.66,4.19 CON502.6 CON502.7
CAN_L
  Top 0.254: U101.6 14.88,5.42 16.16,4.16 CON502.5 | CON502.5 | CON502.4 CON502.5
CAN_RX
  Top 0.25: U100.41 27.25,13.49 26.54,12.78 15.1,12.78 14.25,11.93 14.25,9.22 U101.4
CAN_SHDN
  Top 0.254: U101.5 13,6.61 TP1.TP
CAN_SILENT
  Top 0.25: U100.40 26.75,13.54 26.37,13.16 14.95,13.16 13.76,11.97 13.76,7.57 15.96,7.57 16.19,7.34 U101.8
CAN_TX
  Top 0.25: U100.42 27.75,13.46 26.69,12.4 16.75,12.4 16.18,11.83 U101.1
CLK1
  Top 0.25: C104.1 32.83,15.06 X101.3 32.27,15.12 32.03,15.36 32.03,16.97 31.75,17.25 U100.5
CLK2
  Top 0.25: U100.6 31.69,17.75 31.69,17.74 34.14,17.74 34.42,17.45 X101.1 33.88,16.36 33.58,16.06 33.58,14.59 33.83,14.34 C104.2
GND  (via drill 0.25)
  Top 0.2: U200.10 6.52,9.8 | 6.52,9.8 6.62,9.9 v7.12,9.9 7.27,9.75 U200.4 | 7.27,9.7 6.62,9.7 6.52,9.8
  Top 0.25: U100.47 30.25,15.75 U100.EPAD | U100.36 U100.35 25.75,15.75 U100.EPAD | U100.EPAD 28.75,18.75 U100.8 31.75,18.75 32,18.5 33.97,18.5 34.14,18.67 C103.2 | U100.23 25.75,20.25 U100.EPAD | R408.2 28.05,11.46 28.06,11.45 | U101.2 15.54,9.85 15.65,9.96 15.65,11.16 15.47,11.34 C105.1 | C101.2 C405.2
  Top 0.254: U200.4 7.32,9.1 7.52,9.1 7.8,8.82 C204.2 | U100.23 25.75,22.15 C102.2 | 28.06,11.45 C407.2 | v9.08,21.51 v9.69,21.51 9.72,21.54 U300.7 11.5,21.54 U300.EPAD | v18.64,6.87 v18.65,6.86 v19.26,6.86 19.46,7.06 U400.7 21.1,7.06 U400.EPAD | U100.36 23.64,15.25 v23.62,15.23 | CON502.14 20.66,2.94 v20.17,3.43 | CON502.13 v20.16,3.42 v20.17,3.43 | CON502.12 19.66,2.92 v20.17,3.43
  Bottom 0.25: U302.13 18.72,15.18 C310.2
  Bottom 0.254: C409.2 30.72,4.86 C408.2 | U302.5 20.65,22.18 v20.87,22.4
  other vias: 11.41,14.39 8.56,7.19 12.3,14.4 10,14 7.72,12.8 7.72,13.6 5.32,13.6 5.32,12.8 6.52,12.7 6.52,13.3 6.52,16 1.54,13.97 1.54,13.29 1.54,14.63 2.3,7.36 3.33,7.37 4.07,8.07 32.74,12.7 28.98,10.7 29.15,8.35 30.37,9.97 34.67,13.99 32.79,17.21 28.99,11.48 22.79,8.69 23.48,8.7 23.48,8.05 15.43,12.23 21.55,23.01 23.42,26.31 23.44,26.96 24.13,26.96 34.91,18.75 13,24.54 12,24.54 13,26 19,25 18,25 17,25 16,25 29,28 31,25 38,27 33,22 33.86,12.77 33.08,11.47 34.42,10.17 36.41,11.66 36,7 37,3 31.15,4.04 30.51,4.06 29.56,4.01 28.73,4 27.59,4.01 26.64,4.04 23,3 3,3 18,6 20.56,10.85 9.8,6.69 10.58,6.69 11.63,7.9 13.07,13.26 3,15 5.91,7.48 7.72,7.39 18.72,16.25 17.94,13.85 15,15 6,21 6,23 6,25 6,19 2,17 2,27 10,27 30,2 26,2 26.48,22.11 17.62,7.56 17.02,7.56 21.62,2.26 21.61,1.56 21.61,0.8 19.37,4.52 16.91,21.54 11.25,21.29 12.25,21.29 12.26,22.3 11.24,22.29 21.86,7.8 21.85,6.8 25.89,20.13 27.3,20.13 28.72,20.11 30.11,20.11 30.15,18.69 28.69,18.67 27.33,18.66 25.84,18.65 25.86,17.33 27.32,17.33 28.66,17.35 30.15,17.34 30.13,15.96 28.65,16.37 27.32,16.38 25.84,16.38 10.08,16.4 10.95,16.36 11.89,16.36 12.83,16.36 13.73,16.36
  pour Bottom: 16.87,7.44 16.87,11.87 17,12 17.67,12 17.76,11.91 17.76,7.47 17.69,7.4 16.91,7.4
  pour Top (rank 6): 0,26.5 0,3 arc90 3,0 37,0 arc90 40,3 40,15.99 40,16 40,26.5 arc90 37,29.5 36,29.5 arc90 35,28.5 35,27.5 arc-90 33.5,26 arc-90 32,27.5 32,28.5 arc90 31,29.5 9,29.5 arc90 8,28.5 8,27.5 arc-90 6.5,26 arc-90 5,27.5 5,28.5 arc90 4,29.5 3,29.5 arc90
  pour Bottom (rank 6): 0,26.5 0,3 arc90 3,0 37,0 arc90 40,3 40,15.99 40,16 40,26.5 arc90 37,29.5 36,29.5 arc90 35,28.5 35,27.5 arc-90 33.5,26 arc-90 32,27.5 32,28.5 arc90 31,29.5 9,29.5 arc90 8,28.5 8,27.5 arc-90 6.5,26 arc-90 5,27.5 5,28.5 arc90 4,29.5 3,29.5 arc90
  pour Route2 (rank 6): 0,26.5 0,3 arc90 3,0 37,0 arc90 40,3 40,15.99 40,16 40,26.5 arc90 37,29.5 36,29.5 arc90 35,28.5 35,27.5 arc-90 33.5,26 arc-90 32,27.5 32,28.5 arc90 31,29.5 9,29.5 arc90 8,28.5 8,27.5 arc-90 6.5,26 arc-90 5,27.5 5,28.5 arc90 4,29.5 3,29.5 arc90
M_IN+
  Bottom 0.254: R410.2 27.66,8.91 U401.1 R409.1 C410.1
M_IN-
  Bottom 0.25: U401.5 C411.2 R413.1
  Bottom 0.254: R414.2 27.72,6.83 U401.5
M_PH
  Top 0.25: R403.1 23.16,10.32 22.1,9.26 U400.1
M_PWM
  Top 0.25: R404.1 22.16,9.95 21.6,9.39 U400.2
MAG_CURR_FDB  (via drill 0.25)
  Top 0.25: v30.24,9 31.69,10.45 33.45,10.45 35.52,12.52 v35.52,17.6 | v35.52,19.21 v35.52,19.22 34.99,19.75 U100.10
  Bottom 0.25: v30.24,9 U401.3 29.64,7.86 28.74,6.96 C411.1 R413.2 | v35.52,17.6 v35.52,19.21
MAG_DIR  (via drill 0.25)
  Top 0.25: U100.39 26.25,14.07 25.82,13.64 v24.57,13.64 | v24.32,11.72 24.29,11.75 R403.2
  Bottom 0.25: v24.57,13.64 24.57,11.97 v24.32,11.72
MAG_EN
  Top 0.2: 29.75,13.89 R402.2
  Top 0.254: U100.46 29.75,13.89
MAG_FAULT  (via drill 0.25)
  Top 0.2: C405.1 30.86,12.68 R402.1
  Top 0.25: v25.37,11.57 25.37,10.64 24.46,9.73 24.46,7.1 23.92,6.56 U400.13
  Top 0.254: U100.45 v29.25,13.04 29.25,13.02 29.59,12.68 R402.1
  Bottom 0.25: v29.25,13.04 26.84,13.04 v25.37,11.57
MAG_PWM  (via drill 0.25)
  Top 0.25: U100.38 25.75,14.1 25.66,14.02 24.87,14.02 24.77,14.12 24.37,14.12 23.89,13.64 v22.13,13.64 | v21.24,11.75 R404.2
  Bottom 0.25: v22.13,13.64 21.24,12.75 v21.24,11.75
MAG_STBY  (via drill 0.25)
  Top 0.25: U100.43 28.25,13.25 27.23,12.22 v27.2,12.22 | v24.89,10.84 24.89,10.69 24.08,9.88 24.08,7.51 TP3.TP 23.63,7.06 U400.14
  Bottom 0.25: v27.2,12.22 27.2,12.2 26.75,11.75 C404.1 R401.2 v24.9,10.85 v24.89,10.84
NRST
  Top 0.25: C501.NRST 38,12.5 36.96,13.54 36.96,15.09 36.62,15.43 36.62,16.9 36.24,17.27 36.24,17.73 35.85,18.12 31.85,18.12 31.72,18.25 U100.7
OUT1  (via drill 0.25)
  Top 0.254: U400.3 21.09,9.42 v21.09,9.4 | U400.10 21.1,5.26 v21.08,5.24 v21.09,5.23 | CON502.11 19.16,3.32 19.16,3.46 18.66,2.96 CON502.10
  Top 0.45: 19.16,3.32 20.49,4.65 20.74,4.65 21.09,5 v21.09,5.23
  Bottom 0.254: v21.09,9.4 v21.08,5.24
OUT2  (via drill 0.25)
  Top 0.254: U400.8 v19.96,6 | v19.95,8.65 U400.5 | CON502.9 18.16,4.2 18.16,4.34 17.66,3.84 CON502.8
  Top 0.45: 18.16,4.2 v19.96,6
  Bottom 0.254: v19.96,6 19.95,7 v19.94,8.64 v19.95,8.65
QUAD_A  (via drill 0.25)
  Top 0.25: C501.QUAD_A 38,18.56 36.96,19.6 36.96,20.51 34.64,22.82 28.52,22.82 v28.3,22.61
  Bottom 0.25: U302.7 21.95,21.82 22.74,22.61 v28.3,22.61 | U302.7
QUAD_B  (via drill 0.25)
  Top 0.25: v27.82,23.09 27.93,23.2 34.8,23.2 C501.QUAD_B
  Bottom 0.25: U302.6 21.3,21.91 22.48,23.09 v27.82,23.09
SENSE_BLDC  (via drill 0.25)
  Top 0.254: U300.9 v10.31,20.4 | U300.4 10.97,23.15 v10.32,23.15 | R306.2 R304.1
  Top 0.45: v11.38,25.91 13.39,27.92 R305.2 R306.2
  Bottom 0.254: v10.31,20.4 9.46,20.4 8.53,21.33 8.53,22.62 9.06,23.15 v10.32,23.15
  Bottom 0.45: v10.32,23.15 10.32,24.85 v11.38,25.91
SENSE_MAG  (via drill 0.25)
  Top 0.254: U400.9 20.59,5.33 v20.5,5.24 | U400.4 20.6,9.27 v20.5,9.37
  Top 0.45: v25.87,7.81 v25.87,7.21 | v25.87,7.21 v25.87,6.57 | v25.87,7.21 25.89,7.19
  Top 0.5: 25.89,7.19 R411.1
  Top 0.6: R411.1 R412.1
  Bottom 0.25: R410.1 26.55,7.81 v25.87,7.81
  Bottom 0.254: v20.5,9.37 v20.5,5.24
  Bottom 0.45: v20.5,5.24 20.5,5 20.84,4.66 23.96,4.66 v25.87,6.57
SPI1_MISO  (via drill 0.25)
  Top 0.25: v29.25,22.01 U100.16
  Bottom 0.25: U302.3 19.35,23.32 19.6,23.57 25,23.57 28.02,23.57 29.25,22.34 v29.25,22.01
SPI1_NSS  (via drill 0.25)
  Top 0.25: v30.25,22.01 U100.14
  Bottom 0.25: U302.1 18.05,23.08 19.29,24.32 28.5,24.32 30.25,22.57 v30.25,22.01
SPI1_SCK  (via drill 0.25)
  Top 0.25: v29.75,22.32 U100.15
  Bottom 0.25: U302.2 18.7,23.2 19.45,23.95 28.19,23.95 29.75,22.39 v29.75,22.32
SWCLK  (via drill 0.25)
  Top 0.25: U100.37 24.64,14.62 v24.62,14.65
  Top 0.254: v31.37,8.5 37.5,8.5 C501.SWCLK
  Bottom 0.25: v24.62,14.65 25.36,15.39 29.11,15.39 30.86,13.64 30.86,9.02 v31.37,8.51 v31.37,8.5
SWDIO  (via drill 0.25)
  Top 0.25: U100.34 24.25,16.25 v24,16 v23.99,16
  Top 0.254: v31.43,9.5 37.5,9.5 C501.SWDIO
  Bottom 0.25: v23.99,16 24.23,15.77 29.27,15.77 31.24,13.8 31.24,9.69 v31.43,9.5
TOFF1
  Top 0.25: R407.2 28.07,10.46 C407.1
TPS-EN2
  Top 0.2: R201.1 4.3,10.07 U200.14 5.54,10.07 5.77,9.85 U200.1
  Top 0.254: R201.1 4.15,9.75 4.15,8.89 R202.2
TPS-FB2
  Top 0.2: U200.5 8.79,9.57 R205.2
  Top 0.5: R205.2 8.78,9.84 R204.1
TPS-L5  (via drill 0.25)
  Bottom 0.8: v4.32,11.9 v5.52,11.9
  Bottom 1: v4.32,11.9 v4.32,17.3
  other vias: 4.92,11.9 4.32,14.7 4.32,15.6 4.32,16.4
  pour Top (no thermals): 6.12,10.4 6.12,12.2 4.02,12.2 4.02,11.5 5.52,11.5 5.82,11.2 5.82,10.4
  pour Top (no thermals): 5.72,17.6 5.72,14.4 3.62,14.4 3.62,17.6
TPS-L6  (via drill 0.25)
  Bottom 0.8: v8.72,11.9 v7.52,11.9
  Bottom 1: v8.72,11.9 v8.72,14.7 v8.72,17.3
  other vias: 8.12,11.9 8.72,16.4 8.72,15.6
  pour Top (no thermals): 6.92,10.4 6.92,12.2 9.02,12.2 9.02,11.5 7.52,11.5 7.22,11.2 7.22,10.4
  pour Top (no thermals): 7.32,14.4 7.32,17.6 9.42,17.6 9.42,14.4
TPS-VAUX2
  Top 0.2: U200.3 6.77,8.35
  Top 0.254: 6.77,8.35 C204.1
TPS-VSEL2
  Top 0.254: U200.15 5.12,9.22 4.9,9 R203.2
U
  Top 0.254: U300.3 11.49,23.6 11.29,23.8 JP301.1
UART_RX
  Top 0.25: U100.13 35.56,21.38 36.58,20.35 36.58,19.44 37,19.03 37,17.59 38,16.58 C501.UART_RX
UART_TX
  Top 0.25: U100.12 35.65,20.75 36.2,20.2 36.2,19.29 36.62,18.87 36.62,17.43 37,17.05 37,15.59 38,14.58 C501.UART_TX
V
  Top 0.254: U300.8 10.35,21.03 8.06,21.03 7.29,21.8 JP301.2
VBUS  (via drill 0.25)
  Top 0.254: U300.6 9.75,22.04 v9.69,22.1 | U400.6 v19.24,7.56 v18.65,7.56 | v13.91,3.58 14.16,3.58 CON502.1 | v14.67,3.58 CON502.2 | v15.42,3.57 15.16,3.57 CON502.3
  Top 0.5: C203.1 3.3,10.91 R201.2
  Bottom 0.254: v18.65,7.56 v19.24,7.56
  Bottom 0.6: C301.1 C302.1 C303.1 v9,19 v8.46,19
  other vias: 9.08,22.11 9.37,22.61 0.81,11.94 1.42,11.38 0.84,10.98 1.39,10.45 0.85,10.02 13.16,3.58 13.12,4.48 13.93,4.47 14.66,4.46 9.53,19.01
  pour Top (rank 2, no thermals): 5.32,11.06 4.04,11.06 3.52,11.56 2.74,11.56 2.4,11.9 2.4,12.12 2.22,12.3 0.55,12.3 0.55,9.55 3.5,9.55 3.6,9.65 3.6,10.14 3.92,10.46 5.32,10.46
  pour Top: 10,21.97 10,22.26 9.5,22.76 9.2,22.76 8.88,22.44 8.88,22.04 8.95,21.97
  pour Bottom: 18.5,11.93 18.59,12.02 19.3,12.02 19.4,11.92 19.4,7.43 19.26,7.29 18.61,7.29 18.5,7.4
  pour Route15: 3,0 arc-90 0,3 0,26.5 arc-90 3,29.5 4,29.5 arc-90 5,28.5 5,27.5 arc90 6.5,26 arc90 8,27.5 8,28.5 arc-90 9,29.5 31,29.5 arc-90 32,28.5 32,27.5 arc90 33.5,26 arc90 35,27.5 35,28.5 arc-90 36,29.5 37,29.5 arc-90 40,26.5 40,23.2 29.8,23.2 27,26 14,26 12,24 12,17 9,14 9,9 11,7 17,7 18,8 20,8 24,4 40,4 40,3 arc-90 37,0
  pour Bottom: 3.58,12.32 3.58,9.74 3.45,9.61 0.59,9.61 0.59,12.4 3.5,12.4
  pour Top (rank 5): 12.64,2.49 15.84,2.49 15.84,3.98 15.02,4.8 12.64,4.8
W
  Top 0.254: JP301.3 11.29,19.8 11.49,20 U300.10

### Text on the board
tPlace: 3.3V